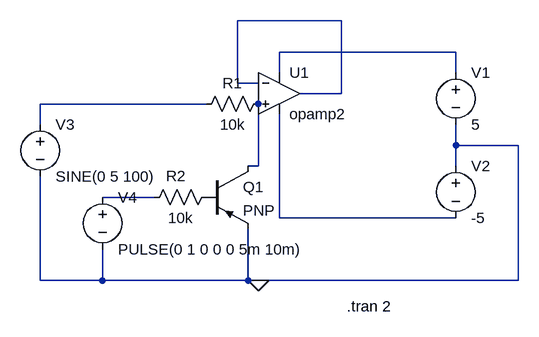
[diagram p0: schematic Draft1.asc]
Draft1.asc, the LTspice schematic file:
Version 4
SHEET 1 880 680
WIRE 448 144 288 144
WIRE 624 192 352 192
WIRE 352 224 352 192
WIRE 624 224 624 192
WIRE 288 240 288 144
WIRE 320 240 288 240
WIRE 448 256 448 144
WIRE 448 256 384 256
WIRE 240 272 -16 272
WIRE -16 304 -16 272
WIRE 624 336 624 304
WIRE 720 336 624 336
WIRE 320 368 320 272
WIRE 320 368 304 368
WIRE 624 368 624 336
WIRE 160 416 80 416
WIRE 352 448 352 288
WIRE 624 448 352 448
WIRE -16 544 -16 384
WIRE 80 544 80 496
WIRE 80 544 -16 544
WIRE 304 544 304 464
WIRE 304 544 80 544
WIRE 320 544 304 544
WIRE 720 544 720 336
WIRE 720 544 320 544
FLAG 320 544 0
SYMBOL OpAmps/opamp2 352 192 R0
SYMATTR InstName U1
SYMBOL voltage 624 208 R0
SYMATTR InstName V1
SYMATTR Value 5
SYMBOL voltage 624 352 R0
SYMATTR InstName V2
SYMATTR Value -5
SYMBOL voltage -16 288 R0
SYMATTR InstName V3
SYMATTR Value SINE(0 5 100)
SYMBOL pnp 240 368 R0
SYMATTR InstName Q1
SYMBOL voltage 80 400 R0
SYMATTR InstName V4
SYMATTR Value PULSE(0 1 0 0 0 5m 10m)
SYMBOL res 336 256 R90
WINDOW 0 0 56 VBottom 2
WINDOW 3 32 56 VTop 2
SYMATTR InstName R1
SYMATTR Value 10k
SYMBOL res 256 400 R90
WINDOW 0 -1 63 VBottom 2
WINDOW 3 32 56 VTop 2
SYMATTR InstName R2
SYMATTR Value 10k
TEXT 456 584 Left 2 !.tran 2

The netlist it stands for:
* Draft1.asc
XU1 N004 N001 N002 N006 N001 opamp2  ; pins In+ In- V+ V- OUT
V1 N002 0 5
V2 0 N006 -5
V3 N003 0 SINE(0 5 100)
Q1 N004 P001 0 0 PNP
V4 N005 0 PULSE(0 1 0 0 0 5m 10m)
R1 N004 N003 10k
R2 P001 N005 10k
.model NPN NPN
.model PNP PNP
.lib standard.bjt
.tran 2
.backanno
.end